# EAGLE design MK8266-O1WF-REV1A (EAGLE 9.5.1)
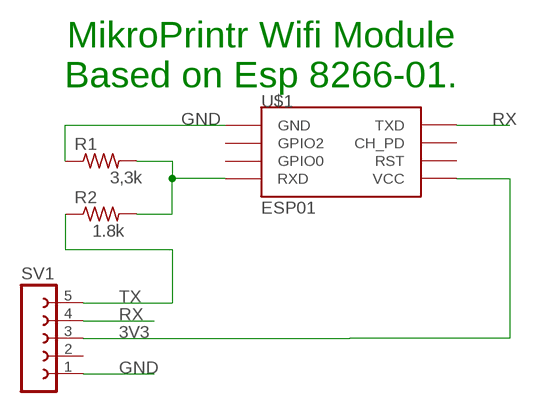
[diagram p0: schematic, sheet 1]

## Parts
R1  3,3k  R-US_0204/7  [0204/7]
R2  1.8k  R-US_0204/7  [0204/7]
SV1  FE05-1  [FE05-1]
U$1  ESP01  [ESP01]

## Nets
3V3: SV1.3 U$1.VCC
GND: R1.1 SV1.1 U$1.GND
N$3: R1.2 R2.2 U$1.RX(RXD)
RX: SV1.4 U$1.TX(TXD)
TX: R2.1 SV1.5
Unconnected: SV1.2 U$1.CH_PD U$1.GPIO0 U$1.GPIO2 U$1.RST

## Notes on the sheet
- MikroPrintr Wifi Module
  Based on Esp 8266-01.

## Library data of the parts
R1 R2 = rcl:R-US_: RESISTOR, American symbol; SPICEPREFIX: R
SV1 = con-lsta:FE05-1: FEMALE HEADER; OC_FARNELL: unknown; OC_NEWARK: unknown
U$1 = esp8266modules:ESP01: ESP8266 Wifi module 01

## Board
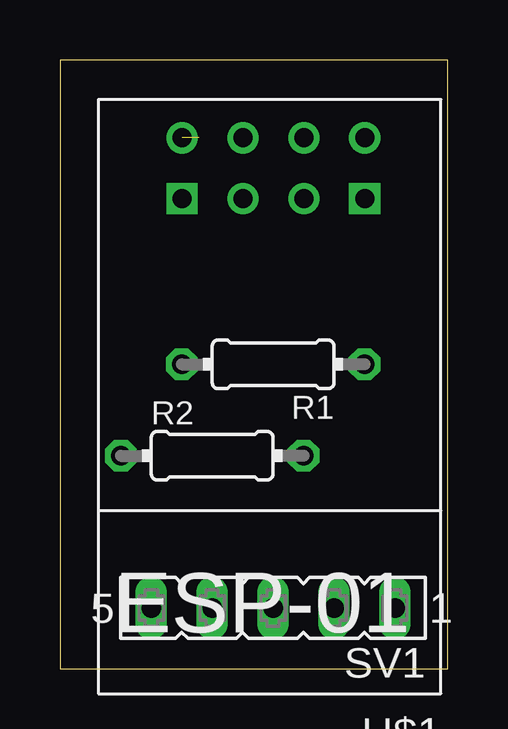
[diagram p1: board, top side]
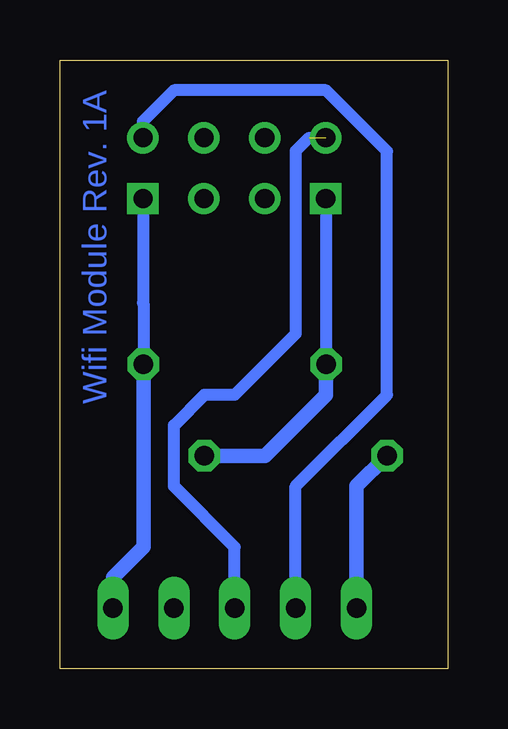
[diagram p2: board, bottom side, seen from below]

Size 16.18 x 25.39 mm. Coordinates in mm from the lower left corner, seen from the top.
Outline: 0,0 16.18,0 16.18,25.39 0,25.39 0,0
Copper layers (1*16): Top 0.035mm / dielectric 1.5mm / Bottom 0.035mm
Design rules "default": minimum track width 6mil, minimum drill 0.35mm, track to track 6mil, track to pad 6mil, pad to pad 6mil, via to via 6mil, smd to smd 6mil, copper to edge 40mil, drill to drill 6mil, minimum pad ring 10mil, minimum via ring 8mil, stop-mask expansion 4mil, vias tented up to drill 0mil, thermal gap 10mil

### Footprints (pad centres in the part's own frame; a part is rotated, then mirrored left to right if it is on the bottom)
0204/7 = drill 0.813 octagon: 1 -3.81,0; 2 3.81,0
FE05-1 = drill 0.813 long: 1 -5.08,0; 2 -2.54,0; 3 0,0; 4 2.54,0; 5 5.08,0
ESP01 = drill 0.8: CH_PD -1.285,-8.178; GPIO0 1.255,-5.638; GPIO2 -1.285,-5.638; RST 1.255,-8.178; TX -3.825,-8.178; VCC 3.795,-8.178 | drill 0.8 square: GND -3.825,-5.638; RX 3.795,-5.638

### Placement (x,y rotation side)
R1  8.89,12.7 180 top
R2  6.35,8.89 0 top
SV1  8.89,2.54 180 top
U$1  8.89,13.97 180 top

### Tracks (layer width: path | path; a pad name or v marks a point on that pad's centre or on a via)
3V3  (1 unrouted)
  Bottom 0.508: SV1.3 8.89,5.08 11.43,7.62 11.43,10.16 10.16,11.43 8.89,11.43 6.35,13.97 6.35,21.59 5.79,22.15
GND
  Bottom 0.508: U$1.GND 12.72,15.25 12.7,15.24 R1.1
  Bottom 0.61: R1.1 12.7,5.08 13.97,3.81 SV1.1
N$3
  Bottom 0.508: U$1.RX 5.1,12.71 R1.2
  Bottom 0.61: R2.2 7.62,8.89 5.08,11.43 R1.2
RX
  Bottom 0.508: SV1.4 6.35,7.62 2.54,11.43 2.54,21.58 5.08,24.12 11.43,24.12 12.72,22.84 U$1.TX
TX
  Bottom 0.61: SV1.5 3.81,7.62 R2.1

### Text on the board
Bottom: Wifi Module Rev. 1A